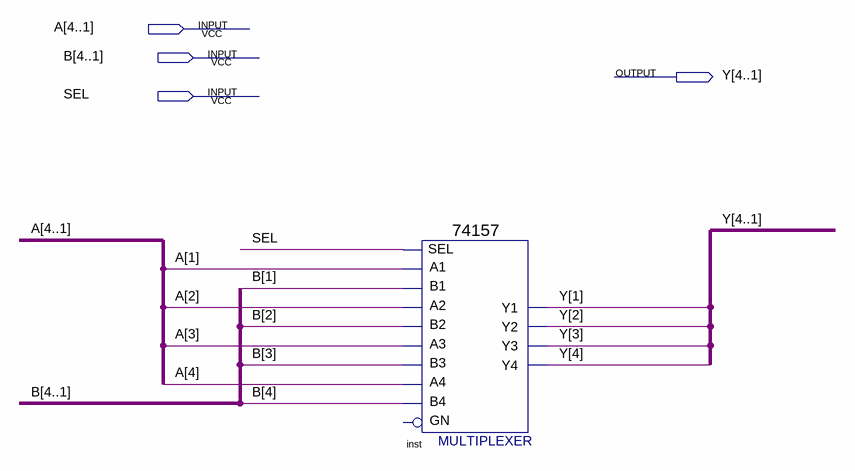
[diagram p0: schematic sheet]
// Quartus schematic ttl74157.bdf as structural Verilog: 1 symbols, 4 pins
module ttl74157 (
  input  [4:1] A,
  input  [4:1] B,
  input  SEL,
  output [4:1] Y
);

  \74157  inst (
    .A1(A[1]), .B1(B[1]), .SEL(SEL), .B2(B[2]), .A3(A[3]), .B3(B[3]), .A2(A[2]), .B4(B[4]), .A4(A[4]),
    .Y2(Y[2]), .Y1(Y[1]), .Y4(Y[4]), .Y3(Y[3]));  // open: GN
endmodule
